# EAGLE design Arduino Ibus (EAGLE 6.5.0)
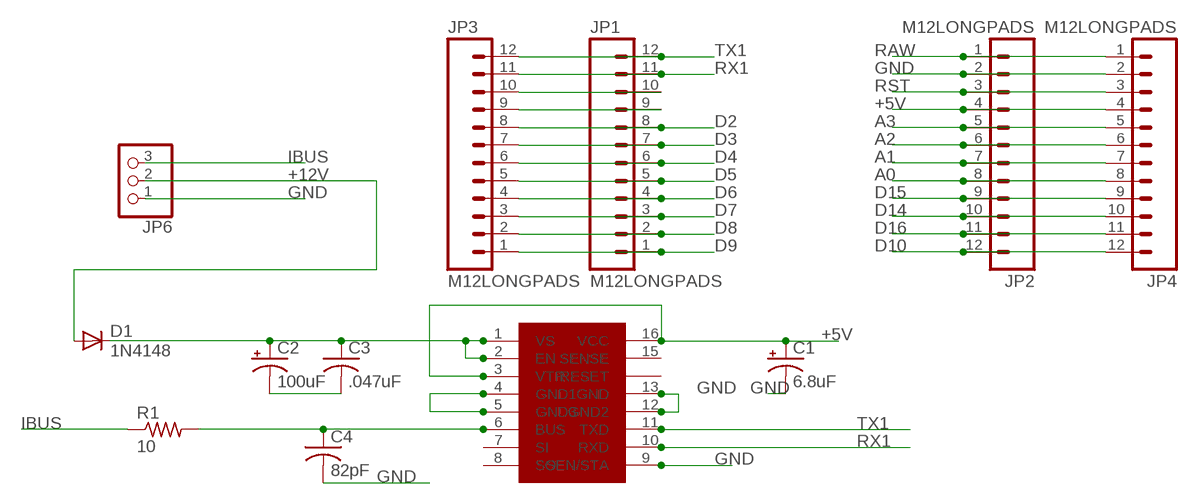
[diagram p0: schematic, sheet 1]

## Parts
C1  6.8uF  CPOL-USE1.8-4  [E1,8-4]
C2  100uF  CPOL-USE3.5-8  [E3,5-8]
C3  .047uF  C-US050-030X075  [C050-030X075]
C4  82pF  C-US050-030X075  [C050-030X075]
D1  1N4148  1N4148DO35-7  [DO35-7]
JP1  M12LONGPADS  [1X12_LONGPADS]
JP2  M12LONGPADS  [1X12_LONGPADS]
JP3  M12LONGPADS  [1X12_LONGPADS]
JP4  M12LONGPADS  [1X12_LONGPADS]
JP6  PINHD-1X3  [1X03]
R1  10  R-US_0207/7  [0207/7]
U$1  TH3122  [SO16W]

## Nets
+5V [POWER]: C1.+ JP2.4 JP4.4 U$1.3(VTR) U$1.16(VCC)
+12V [POWER]: D1.A JP6.2
A0: JP2.8 JP4.8
A1: JP2.7 JP4.7
A2: JP2.6 JP4.6
A3: JP2.5 JP4.5
D2: JP1.8 JP3.8
D3: JP1.7 JP3.7
D4: JP1.6 JP3.6
D5: JP1.5 JP3.5
D6: JP1.4 JP3.4
D7: JP1.3 JP3.3
D8: JP1.2 JP3.2
D9: JP1.1 JP3.1
D10: JP2.12 JP4.12
D14: JP2.10 JP4.10
D15: JP2.9 JP4.9
D16: JP2.11 JP4.11
GND [GND]: C1.- C2.- C3.2 C4.2 JP2.2 JP4.2 JP6.1 U$1.4(GND1) U$1.5(GND3) U$1.9(SEN/STA) U$1.12(GND2) U$1.13(GND)
IBUS: JP6.3 R1.1
N$1: JP1.10 JP3.10
N$2: JP1.9 JP3.9
N$3: C2.+ C3.1 D1.C U$1.1(VS) U$1.2(EN)
N$4: C4.1 R1.2 U$1.6(BUS)
RAW: JP2.1 JP4.1
RST: JP2.3 JP4.3
RX1: JP1.11 JP3.11 U$1.10(RXD)
TX1: JP1.12 JP3.12 U$1.11(TXD)
Unconnected: U$1.7(SI) U$1.8(SO) U$1.14(RESET) U$1.15(SENSE)

## Library data of the parts
C1 C2 = resistor:CPOL-US: POLARIZED CAPACITOR, American symbol
C3 C4 = resistor:C-US: CAPACITOR, American symbol
D1 = diode:1N4148: DIODE high speed (Philips)
JP1-JP4 = SparkFun-Connectors:M12: Header 12 Standard 12-pin 0.1" header. Use with straight break away headers (SKU : PRT-00116), right angle break away headers (PRT-00553), swiss pins (PRT-00743), machine pins (PRT-00117), and female headers (PRT-00115).
JP6 = pinhead:PINHD-1X3: PIN HEADER
R1 = resistor:R-US_: RESISTOR, American symbol
U$1 = Melexisth3122:TH3122

## Net classes
0 default: width 0.254 mm, drill 0.508 mm, clearance 0.508 mm
1 GND: width 0.508 mm, drill 0.508 mm, clearance 0.508 mm
2 POWER: width 0.508 mm, drill 0.508 mm, clearance 0.508 mm

## Board
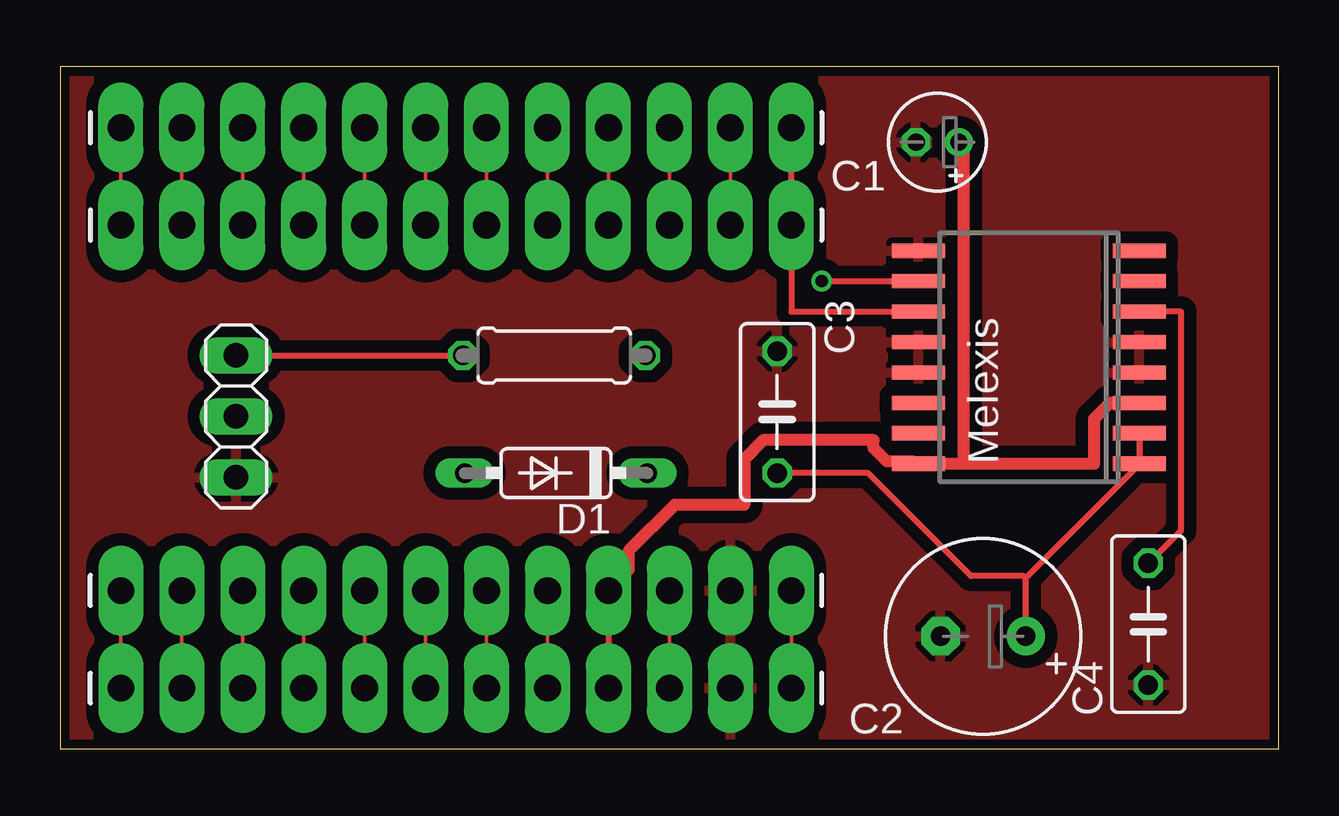
[diagram p1: board, top side]
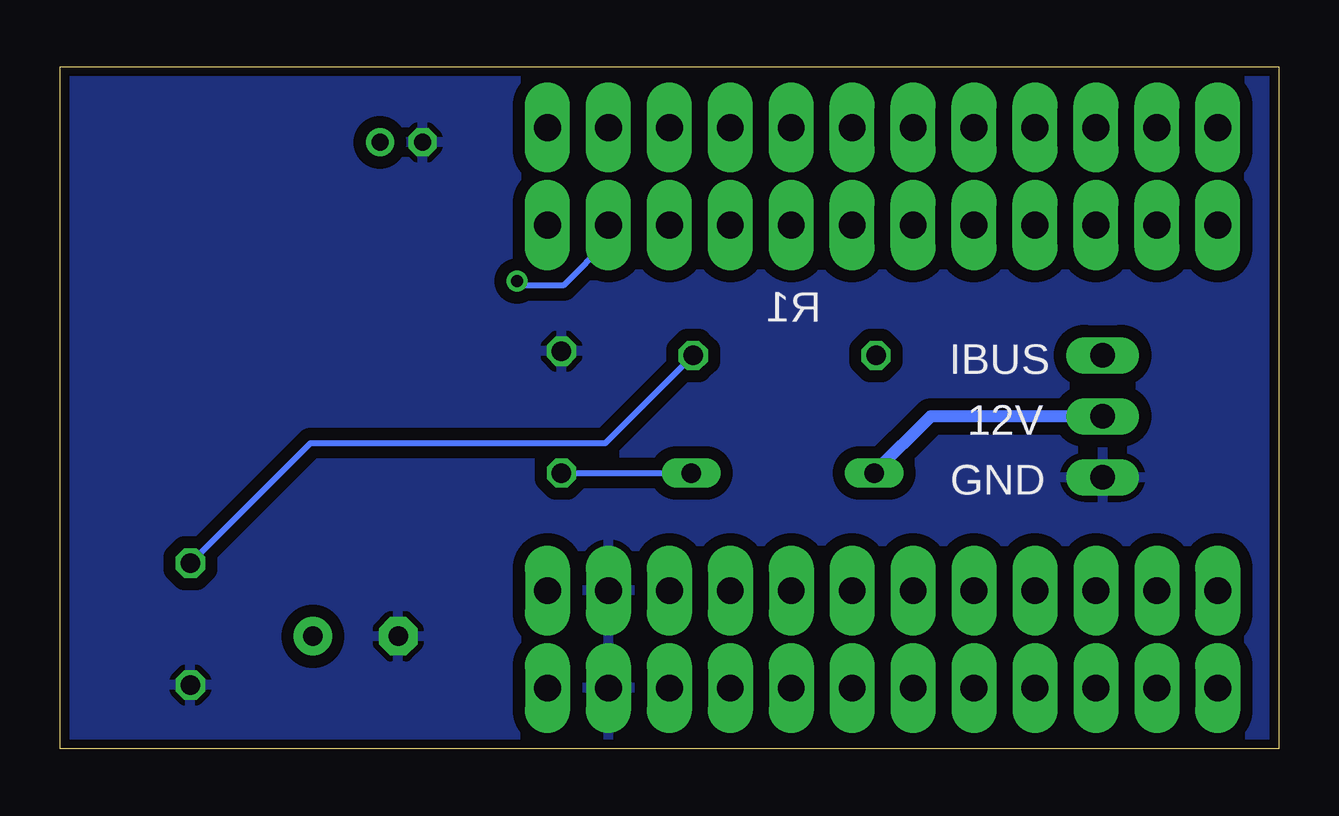
[diagram p2: board, bottom side, seen from below]

Size 50.8 x 28.45 mm. Coordinates in mm from the lower left corner, seen from the top.
Outline: 0,0 50.8,0 50.8,28.45 0,28.45 0,0
Copper layers (1*16): Top 0.0356mm / dielectric 1.5011mm / Bottom 0.0356mm
Design rules "default": minimum track width 6mil, minimum drill 13mil, track to track 6mil, track to pad 6mil, pad to pad 6mil, via to via 6mil, smd to smd 6mil, copper to edge 15mil, drill to drill 6mil, minimum pad ring 7mil, minimum via ring 7mil, stop-mask expansion 4mil, vias tented up to drill 0mil, thermal gap 10mil

### Footprints (pad centres in the part's own frame; a part is rotated, then mirrored left to right if it is on the bottom)
E1,8-4 = drill 0.711 pad 1.168: + -0.889,0 | drill 0.711 pad 1.168 octagon: - 0.889,0
E3,5-8 = drill 0.813 pad 1.6: + -1.778,0 | drill 0.813 pad 1.6 octagon: - 1.778,0
C050-030X075 = drill 0.813 octagon: 1 -2.54,0; 2 2.54,0
DO35-7 = drill 0.813 long: A 3.81,0; C -3.81,0
1X12_LONGPADS = drill 1.118 pad 1.88 long: 1 0,0; 2 2.54,0; 3 5.08,0; 4 7.62,0; 5 10.16,0; 6 12.7,0; 7 15.24,0; 8 17.78,0; 9 20.32,0; 10 22.86,0; 11 25.4,0; 12 27.94,0
1X03 = drill 1.016 long: 1 -2.54,0; 2 0,0; 3 2.54,0
0207/7 = drill 0.813 octagon: 1 -3.81,0; 2 3.81,0
SO16W = smd 0.6 x 2.2: 1 -4.445,-4.6; 2 -3.175,-4.6; 3 -1.905,-4.6; 4 -0.635,-4.6; 5 0.635,-4.6; 6 1.905,-4.6; 7 3.175,-4.6; 8 4.445,-4.6; 9 4.445,4.6; 10 3.175,4.6; 11 1.905,4.6; 12 0.635,4.6; 13 -0.635,4.6; 14 -1.905,4.6; 15 -3.175,4.6; 16 -4.445,4.6

### Placement (x,y rotation side)
C1  36.58,25.3 180 top
C2  38.48,4.7 180 top
C3  29.9,14.05 90 top
C4  45.36,5.21 270 top
D1  20.68,11.51 180 top
JP1  2.54,21.84 0 top
JP2  30.48,2.54 180 top
JP3  2.54,25.91 0 top
JP4  30.48,6.6 180 top
JP6  7.34,13.87 90 top
R1  20.6,16.41 0 top
U$1  40.39,16.33 90 top

### Tracks (layer width: path | path; a pad name or v marks a point on that pad's centre or on a via)
+5V
  Top 0.254: JP4.4 JP2.4
  Top 0.508: 37.67,11.89 43.1,11.89 43.1,13.77 43.76,14.43 U$1.3 | 37.67,11.89 U$1.16 35.53,11.99 34.47,11.99 33.91,12.55 33.91,12.88 29.31,12.88 28.52,12.09 28.52,10.19 25.63,10.19 23.7,8.26 23.7,7.47 22.94,6.71 JP4.4 | C1.+ 37.67,25.09 37.67,11.89
+12V
  Bottom 0.508: D1.A 14.5,13.87 JP6.2
A0
  Top 0.152: JP4.8 JP2.8
A1
  Top 0.152: JP4.7 JP2.7
A2
  Top 0.152: JP4.6 JP2.6
A3
  Top 0.152: JP4.5 JP2.5
D2
  Top 0.152: JP3.8 JP1.8
D3
  Top 0.152: JP1.7 JP3.7
D4
  Top 0.152: JP1.6 JP3.6
D5
  Top 0.152: JP3.5 JP1.5
D6
  Top 0.152: JP3.4 JP1.4
D7
  Top 0.152: JP3.3 JP1.3
D8
  Top 0.152: JP3.2 JP1.2
D9
  Top 0.152: JP3.1 JP1.1
D10
  Top 0.152: JP4.12 JP2.12
D14
  Top 0.152: JP4.10 JP2.10
D15
  Top 0.152: JP4.9 JP2.9
D16
  Top 0.152: JP4.11 JP2.11
GND
  pour Bottom: 0,0 0,28.45 50.8,28.45 50.8,0
  pour Top: 0,0 0,28.45 50.8,28.45 50.8,0
IBUS
  Top 0.254: JP6.3 R1.1
N$1
  Top 0.152: JP3.10 JP1.10
N$2
  Top 0.152: JP3.9 JP1.9
N$3
  Top 0.254: U$1.2 U$1.1 44.91,11.79 40.26,7.14 | C2.+ 40.26,7.14 | C3.1 33.68,11.51 37.97,7.21 40.16,7.21 40.26,7.14
  Bottom 0.254: C3.1 D1.C
N$4
  Top 0.254: U$1.6 46.74,18.24 46.74,9.12 C4.1
  Bottom 0.254: R1.2 28.07,12.75 40.36,12.75 C4.1
RAW
  Top 0.152: JP4.1 JP2.1
RST
  Top 0.152: JP4.3 JP2.3
RX1  (via drill 0.51)
  Top 0.152: JP1.11 JP3.11
  Top 0.254: v31.75,19.51 U$1.10
  Bottom 0.254: v31.75,19.51 31.57,19.33 29.82,19.33 27.94,21.21 JP1.11
TX1
  Top 0.254: U$1.11 30.48,18.24 JP1.12 JP3.12

### Text on the board
bNames: IBUS | 12V | GND